# EAGLE design SC70_SOT23 (EAGLE 9.2.1)
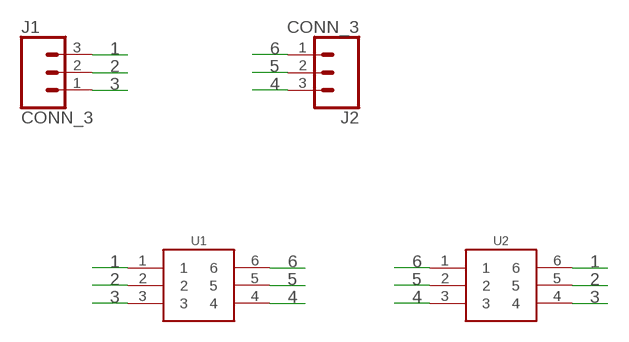
[diagram p0: schematic, sheet 1]

## Parts
J1  CONN_3  [1X03]
J2  CONN_3  [1X03]
U1  GEN_6SC-70  [DCK_R-PDSO-G6]
U2  GEN_6SOT-23  [DDC_R-PDSO-G6]

## Nets
1: J1.3 U1.1 U2.6
2: J1.2 U1.2 U2.5
3: J1.1 U1.3 U2.4
4: J2.3 U1.4 U2.3
5: J2.2 U1.5 U2.2
6: J2.1 U1.6 U2.1

## Library data of the parts
J1 J2 = bschulz:CONN_3: Genaric 3 terminal header Digikey 2.54_SCREW <https://www.digikey.com/product-detail/en/on-shore-technology-inc/OSTVN03A150/ED10562-ND/1588863> 3.5_SCREW <https://www.digikey.com/product-detail/en/on-shore-technology-inc/OSTTE030161/ED2636-ND/614585>
U1 U2 = bschulz:GEN_6: Genaric 6 Pin Device

## Board
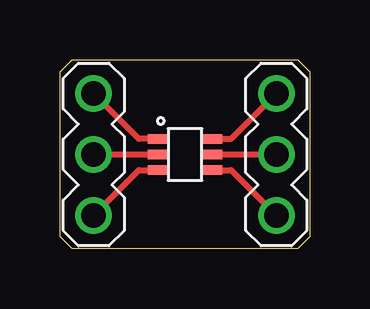
[diagram p1: board, top side]
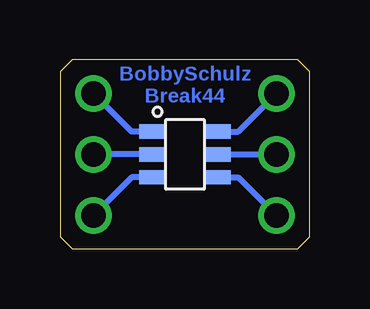
[diagram p2: board, bottom side, seen from below]

Size 10.41 x 7.87 mm. Coordinates in mm from the lower left corner, seen from the top.
Outline: 9.91,0 0.5,0 0,0.5 0,7.37 0.5,7.87 9.91,7.87 10.41,7.37 10.41,0.5 9.91,0
Copper layers (1*16): Top 0.035559375mm / dielectric 1.6mm / Bottom 0.035559375mm
Design rules "oshpark-2layer": minimum track width 6mil, minimum drill 10mil, track to track 6mil, track to pad 6mil, pad to pad 6mil, via to via 6mil, smd to smd 6mil, copper to edge 15mil, drill to drill 6mil, minimum pad ring 5mil, minimum via ring 5mil, stop-mask expansion 2.5mil, vias tented up to drill 0mil, thermal gap 10mil

### Footprints (pad centres in the part's own frame; a part is rotated, then mirrored left to right if it is on the bottom)
1X03 = drill 1.016: 1 -2.54,0; 2 0,0; 3 2.54,0
DCK_R-PDSO-G6 = smd 0.4 x 0.9: 1 -0.65,-1.1; 2 0,-1.1; 3 0.65,-1.1; 4 0.65,1.1; 5 0,1.1; 6 -0.65,1.1
DDC_R-PDSO-G6 = smd 0.6 x 1.1: 1 -0.95,-1.35; 2 0,-1.35; 3 0.95,-1.35; 4 0.95,1.35; 5 0,1.35; 6 -0.95,1.35

### Placement (x,y rotation side)
J1  1.4,3.94 90 top
J2  9.02,3.94 270 top
U1  5.21,3.94 270 top
U2  5.21,3.94 270 bottom

### Tracks (layer width: path | path; a pad name or v marks a point on that pad's centre or on a via)
1
  Top 0.254: U1.1 3.29,4.59 J1.3
  Bottom 0.254: U2.6 2.99,4.89 J1.3
2
  Top 0.254: J1.2 U1.2
  Bottom 0.254: U2.5 J1.2
3
  Top 0.254: J1.1 3.29,3.29 U1.3
  Bottom 0.254: U2.4 2.99,2.99 J1.1
4
  Top 0.254: U1.4 7.13,3.29 J2.3
  Bottom 0.254: U2.3 7.43,2.99 J2.3
5
  Top 0.254: U1.5 J2.2
  Bottom 0.254: U2.2 J2.2
6
  Top 0.254: U1.6 7.13,4.59 J2.1
  Bottom 0.254: U2.1 7.43,4.89 J2.1

### Text on the board
Bottom: BobbySchulz / Break44
tDocu: 1 | 6 | 2 | 5 | SC-70 | 3 | 4
bDocu: 6 | 1 | 5 | 2 | SOT-23 | 4 | 3